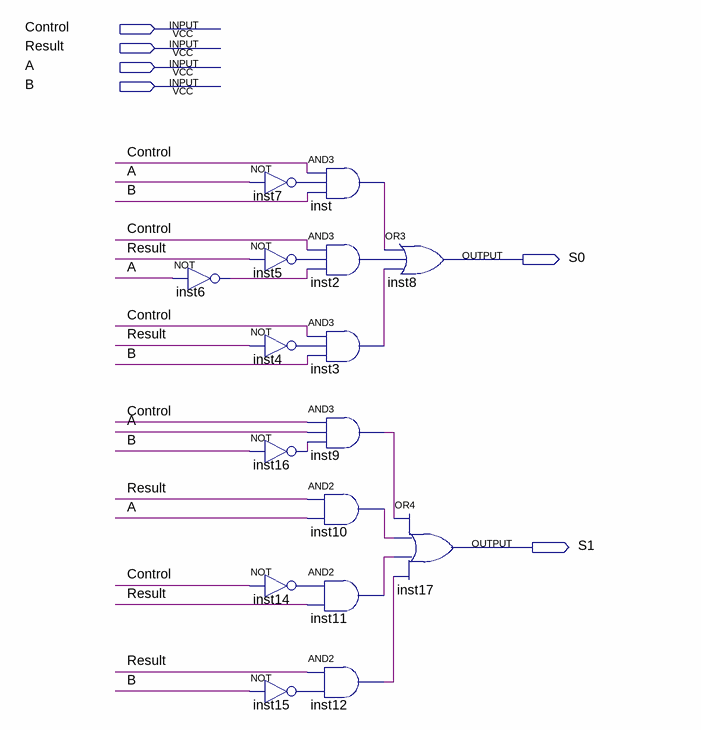
[diagram p0: schematic sheet]
// Quartus schematic Control_absmax.bdf as structural Verilog: 16 symbols, 6 pins
module Control_absmax (
  input  Control,
  input  Result,
  input  A,
  input  B,
  output S0,
  output S1
);

  wire inst2_out, inst3_out, inst4_out, inst5_out, inst6_out, inst7_out, inst9_out, inst10_out, inst11_out,
       inst12_out, inst14_out, inst15_out, inst16_out, inst_out;

  not inst6 (inst6_out, A);
  not inst7 (inst7_out, A);
  not inst5 (inst5_out, Result);
  not inst4 (inst4_out, Result);
  not inst16 (inst16_out, B);
  not inst14 (inst14_out, Control);
  not inst15 (inst15_out, B);
  and inst (inst_out, Control, inst7_out, B);
  and inst2 (inst2_out, Control, inst5_out, inst6_out);
  and inst3 (inst3_out, Control, inst4_out, B);
  and inst9 (inst9_out, Control, A, inst16_out);
  and inst10 (inst10_out, Result, A);
  and inst11 (inst11_out, inst14_out, Result);
  and inst12 (inst12_out, Result, inst15_out);
  or inst8 (S0, inst_out, inst2_out, inst3_out);
  or inst17 (S1, inst9_out, inst10_out, inst11_out, inst12_out);
endmodule
